# EAGLE design arduinoVisor3 (EAGLE 9.5.2)

## Sheet 1 of 2
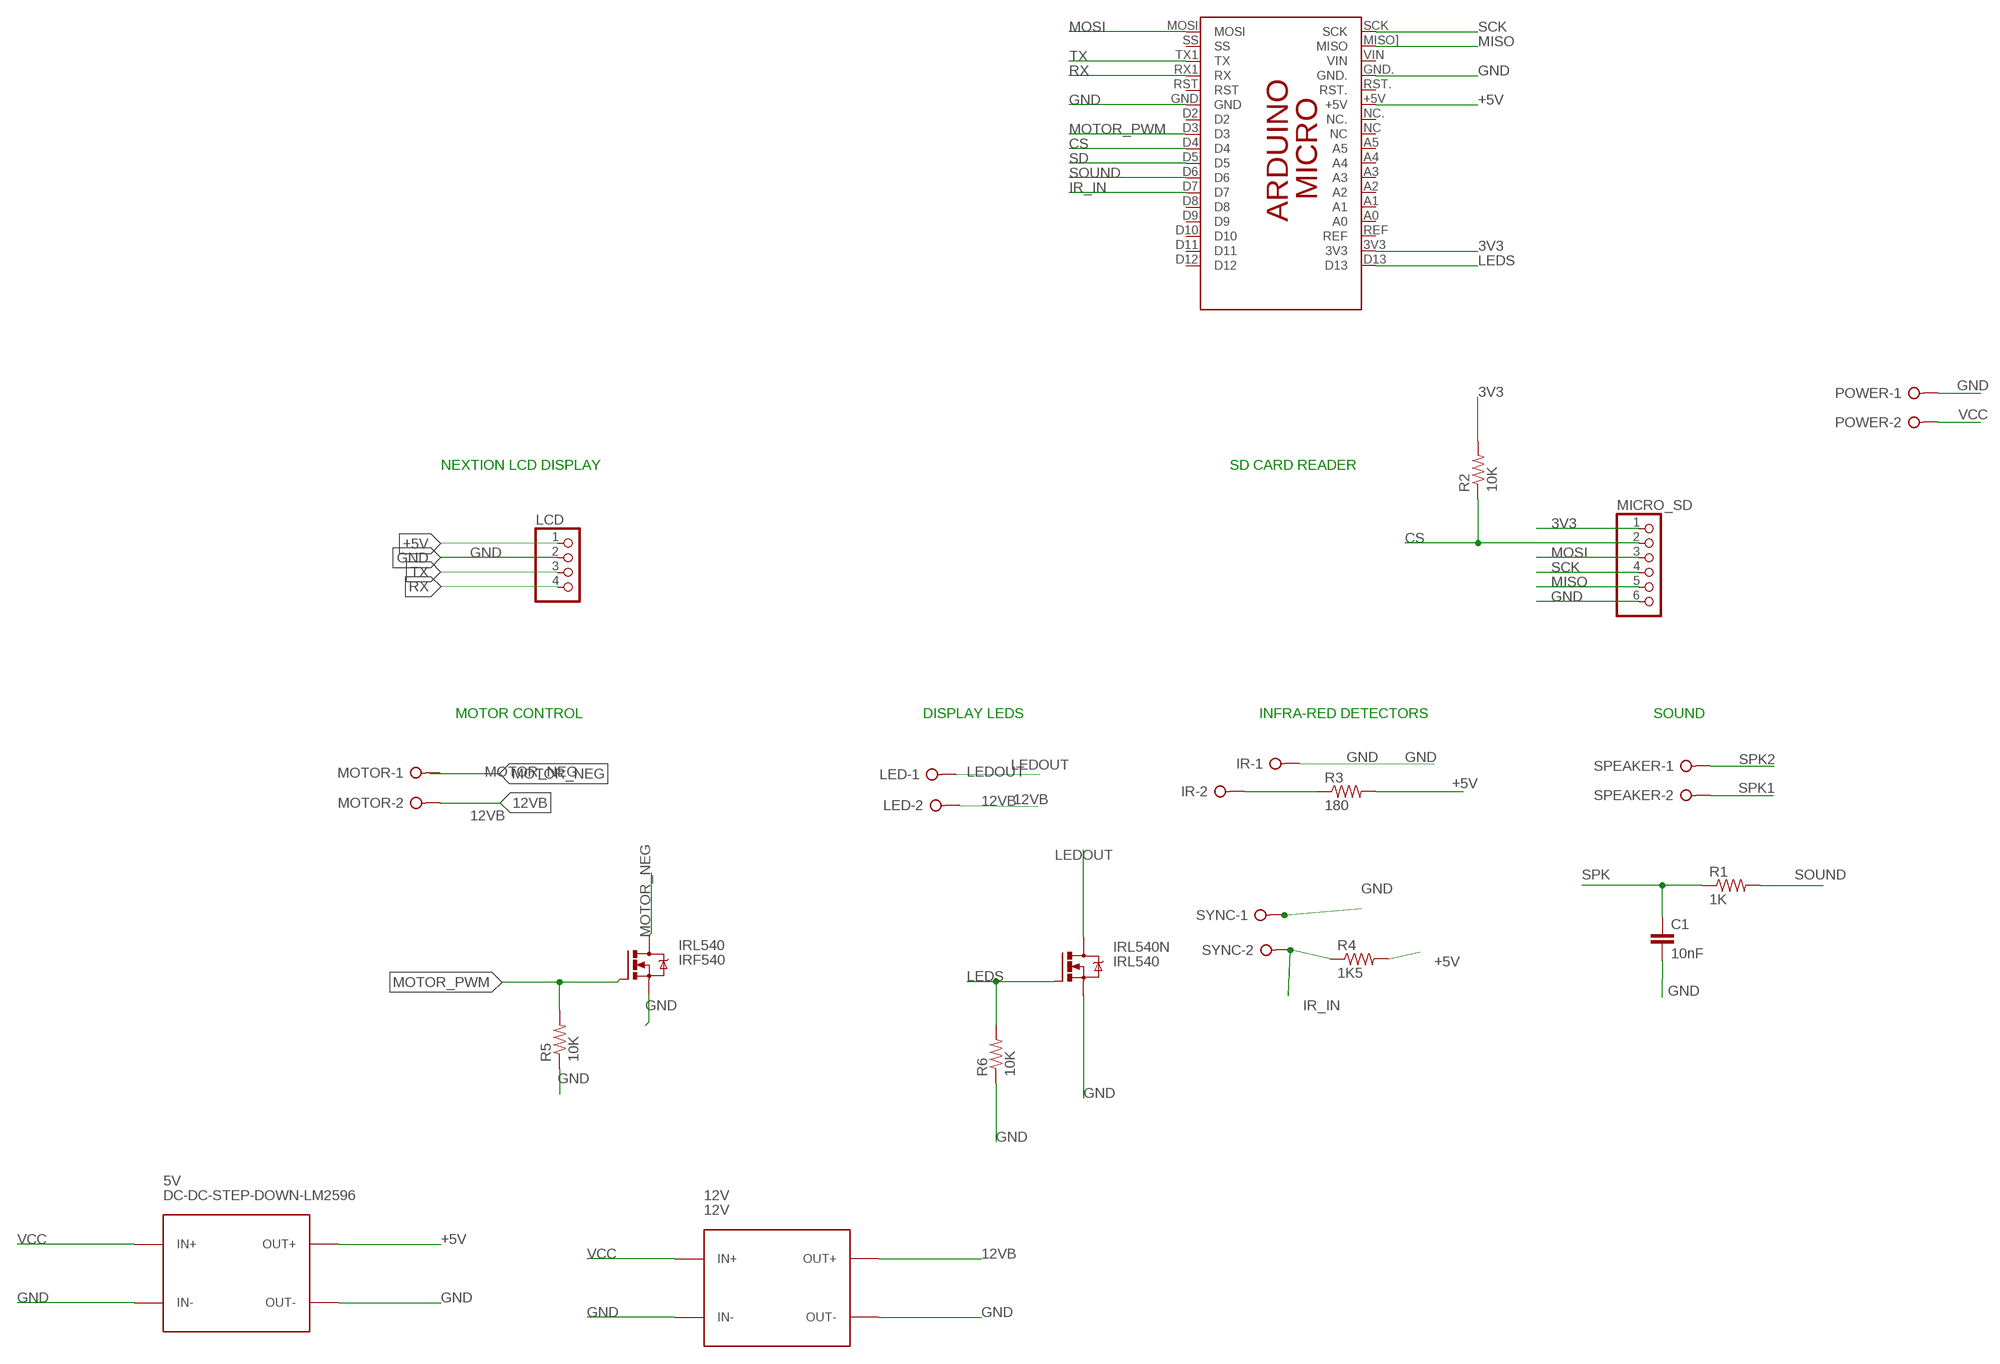
[diagram p0: schematic, sheet 1]

### Parts
5V  DC-DC-STEP-DOWN-LM2596  [DC-DC-STEP-DOWN-LM2596]
12V  12V  DC-DC-STEP-DOWN-LM2596  [DC-DC-STEP-DOWN-LM2596]
C1  10nF  C2.5/2  [C2.5-2]
IR  W237-02P  [W237-132]
IRL540  IRF540  [TO220BV]
IRL540N  IRL540  IRF540  [TO220BV]
LCD  PINHD-1X4  [1X04]
LED  W237-02P  [W237-132]
MICRO_SD  PINHD-1X6  [1X06]
MOTOR  W237-02P  [W237-132]
PCB2  ARDUINO_MICRO  [ARDUINO_MICRO]
POWER  W237-02P  [W237-132]
R1  1K  R-US_0207/10  [0207/10]
R2  10K  R-US_0207/10  [0207/10]
R3  180  R-US_0207/10  [0207/10]
R4  1K5  R-US_0207/10  [0207/10]
R5  10K  R-US_0207/10  [0207/10]
R6  10K  R-US_0207/10  [0207/10]
SPEAKER  W237-02P  [W237-132]
SYNC  W237-02P  [W237-132]

### Nets
3V3: MICRO_SD.1 PCB2.3V3 R2.2
12VB: 12V.OUT+ LED.2 MOTOR.2
+5V: 5V.OUT+ LCD.1 PCB2.+5V R3.2 R4.2 ; also sheet 2
CS: MICRO_SD.2 PCB2.D4 R2.1
GND: 5V.IN- 5V.OUT- 12V.IN- 12V.OUT- C1.2 IR.1 IRL540.S IRL540N.S LCD.2 MICRO_SD.6 PCB2.GND PCB2.GND. POWER.1 R5.1 R6.1 SYNC.1 ; also sheet 2
IR_IN: PCB2.D7 R4.1 SYNC.2
IR_OUT: IR.2 R3.1
LEDOUT: IRL540N.D LED.1
LEDS: IRL540N.G PCB2.D13 R6.2
MISO: MICRO_SD.5 PCB2.MISO](MISO)
MOSI: MICRO_SD.3 PCB2.MOSI
MOTOR_NEG: IRL540.D MOTOR.1
MOTOR_PWM: IRL540.G PCB2.D3 R5.2
RX: LCD.4 PCB2.RX1(RX)
SCK: MICRO_SD.4 PCB2.SCK
SD: PCB2.D5 ; also sheet 2
SOUND: PCB2.D6 R1.2
SPK: C1.1 R1.1 ; also sheet 2
SPK1: SPEAKER.2 ; also sheet 2
SPK2: SPEAKER.1 ; also sheet 2
TX: LCD.3 PCB2.TX1(TX)
VCC: 5V.IN+ 12V.IN+ POWER.2
Unconnected: PCB2.A0 PCB2.A1 PCB2.A2 PCB2.A3 PCB2.A4 PCB2.A5 PCB2.D2 PCB2.D8 PCB2.D9 PCB2.D10 PCB2.D11 PCB2.D12 PCB2.NC PCB2.NC. PCB2.REF PCB2.RST PCB2.RST. PCB2.SS PCB2.VIN

### Notes on the sheet
- NEXTION LCD DISPLAY | SD CARD READER
- MOTOR CONTROL | DISPLAY LEDS | INFRA-RED DETECTORS | SOUND

## Sheet 2 of 2
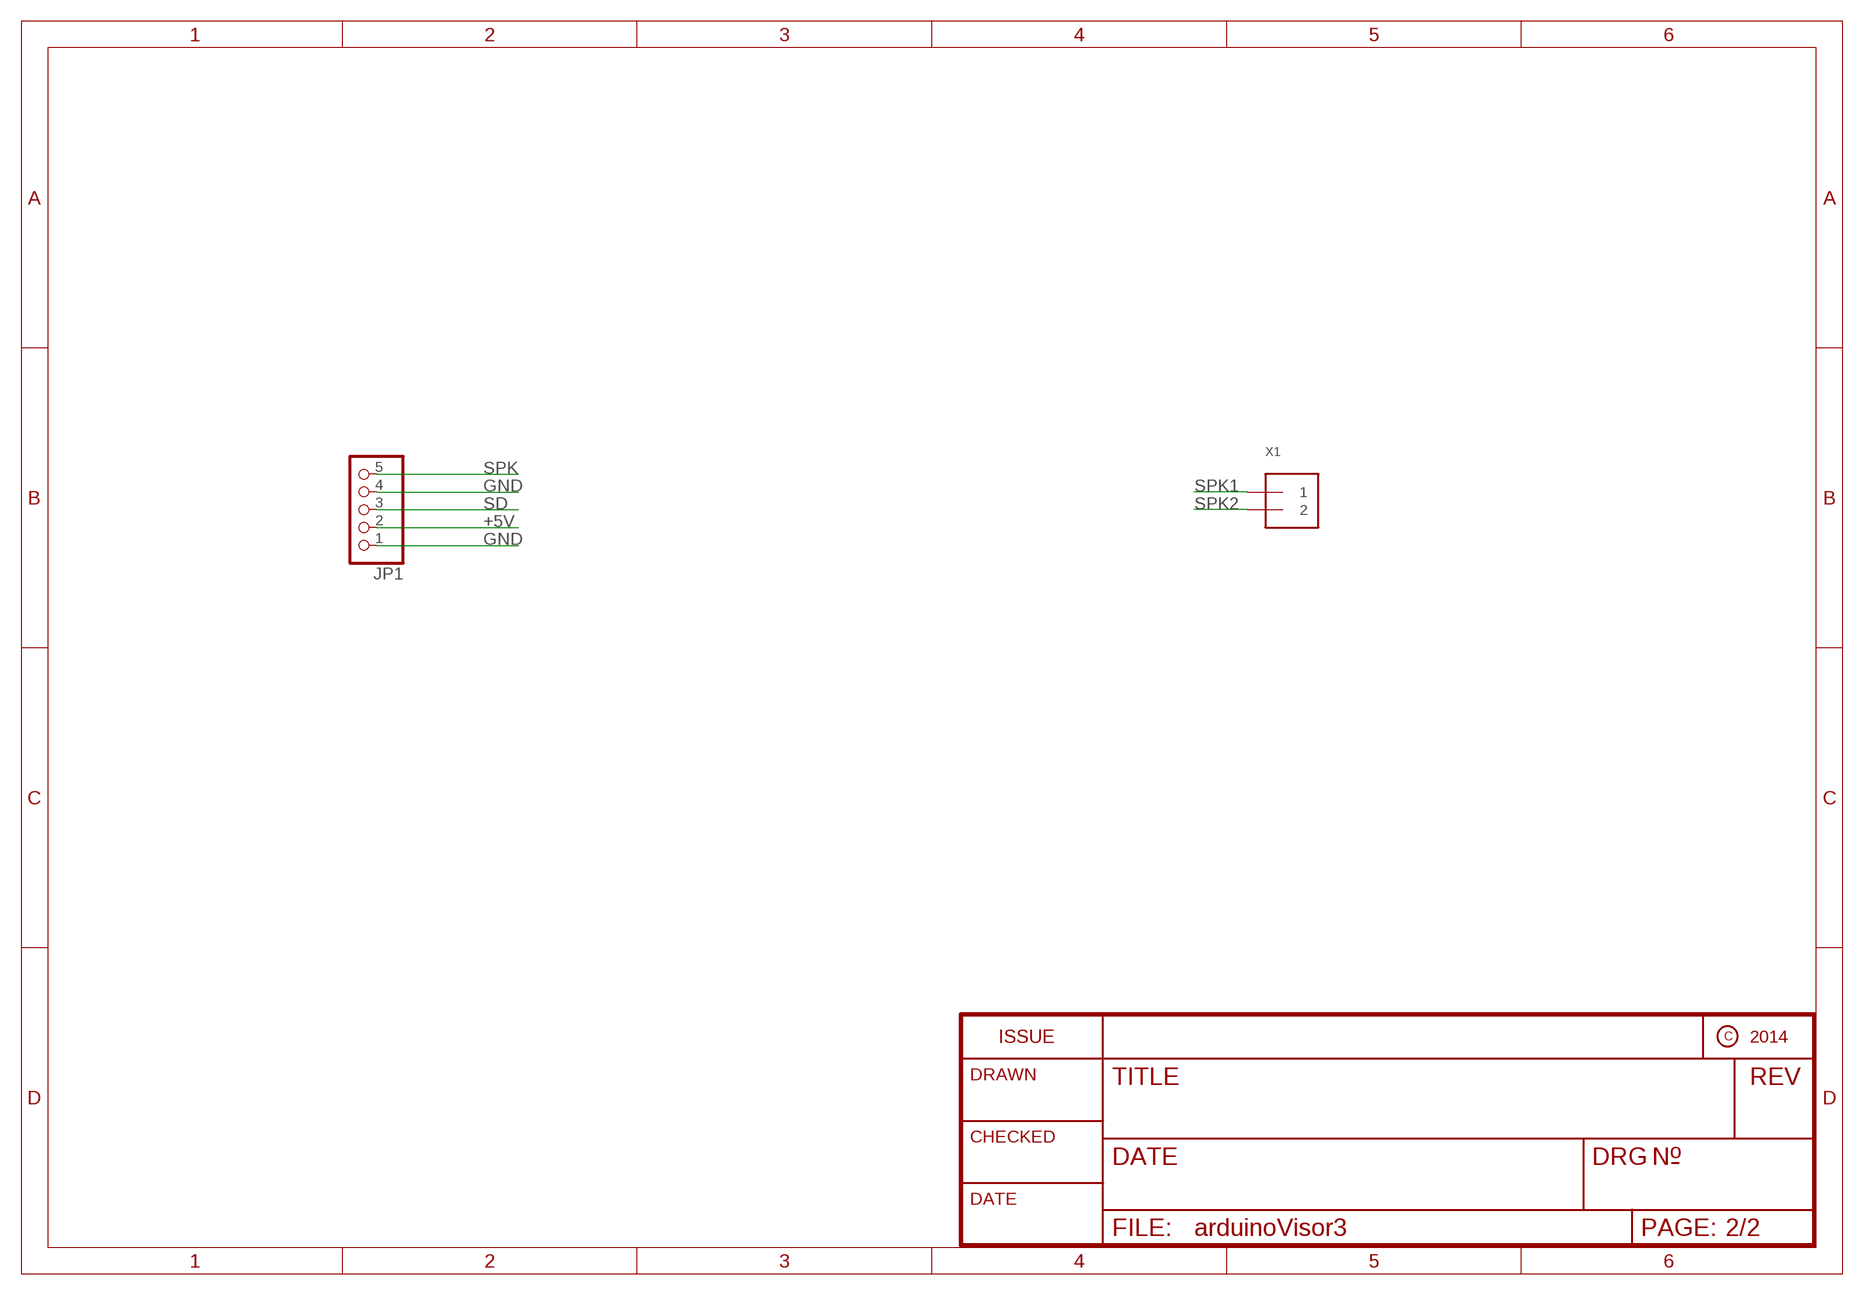
[diagram p1: schematic, sheet 2]

### Parts
JP1  HEADER-1X570MIL  [1X05_ROUND_70]
X1  TERMBLOCK_1X2  [TERMBLOCK_1X2-3.5MM]

### Nets
+5V: JP1.2 ; also sheet 1
GND: JP1.1 JP1.4 ; also sheet 1
SD: JP1.3 ; also sheet 1
SPK: JP1.5 ; also sheet 1
SPK1: X1.1 ; also sheet 1
SPK2: X1.2 ; also sheet 1

## Library data of the parts
5V 12V = diy-modules boo:DC-DC-STEP-DOWN-LM2596: DC/DC Step-Down Regulator based on LM2596-ADJ chip LM2596 datasheet available here: http://www.ti.com/lit/ds/symlink/lm2596.pdf Click here to find device on ebay.com <http://www.ebay.com/sch/lm2596+power+regulator>
C1 = capacitor-wima:C: CAPACITOR naming: grid - package width
IR LED MOTOR POWER SPEAKER SYNC = con-wago-508:W237-02P: WAGO SREW CLAMP; OC_FARNELL: unknown; OC_NEWARK: unknown
IRL540 IRL540N = transistor-power:IRF540: HEXFET Power MOSFET
JP1 = microbuilder:HEADER-1X5: PIN HEADER
LCD = pinhead:PINHD-1X4: PIN HEADER
MICRO_SD = pinhead:PINHD-1X6: PIN HEADER
PCB2 = E14_Arduino_revC 2 boo:ARDUINO_MICRO: Device for representing an Arduino Micro board with a footprint in an EAGLE design. Created by Dave Young for Element14. More EAGLE documentation at: http://www.element14.com/community/community/knode/cadsoft_eagle
R1-R6 = rcl:R-US_: RESISTOR, American symbol
X1 = microbuilder:TERMBLOCK_1X2: 3.5mm Terminal block http://www.ladyada.net/library/pcb/eaglelibrary.html

## Board
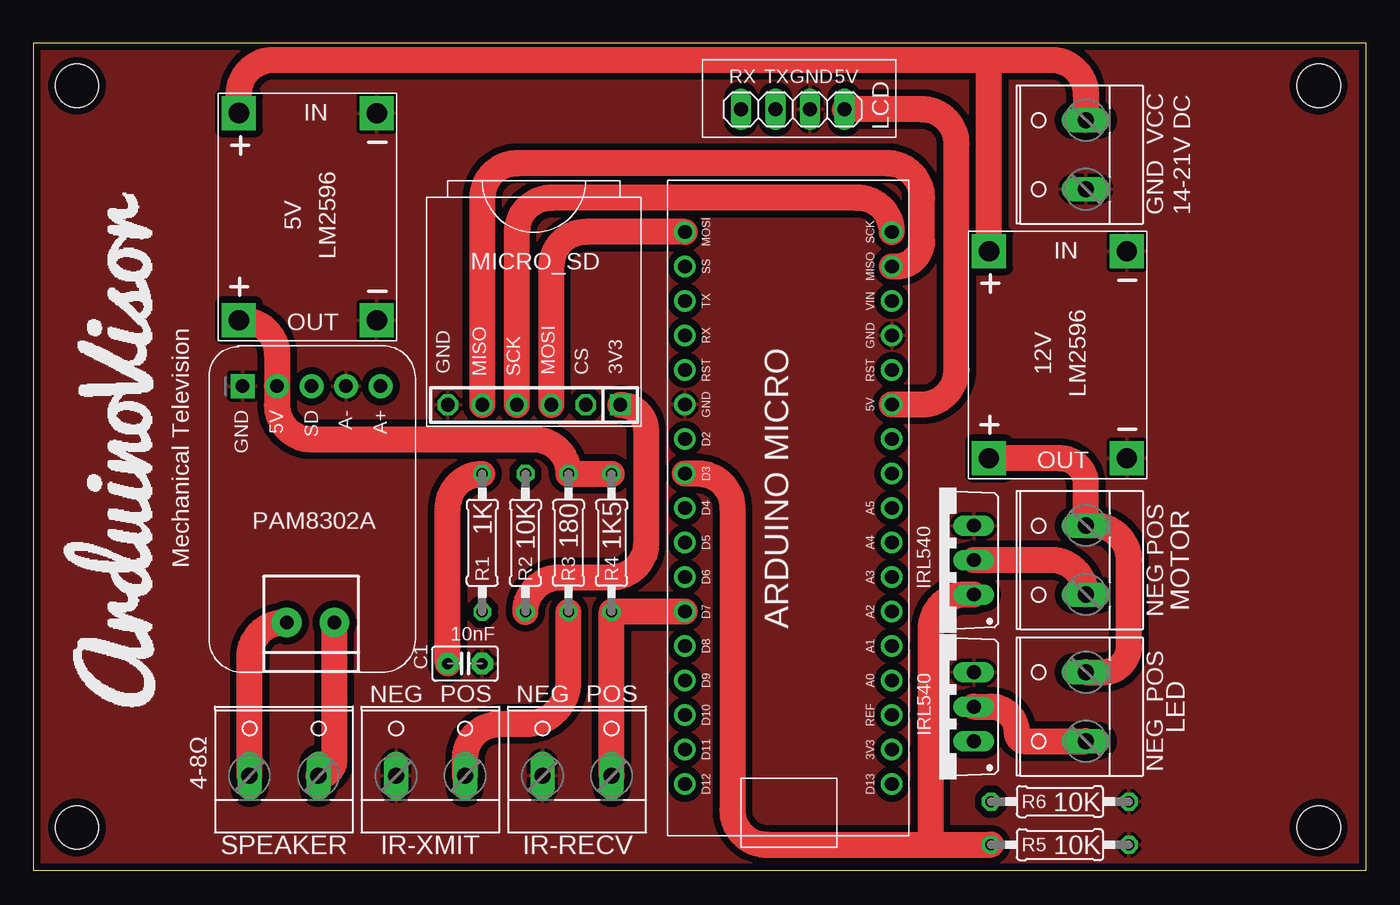
[diagram p2: board, top side]
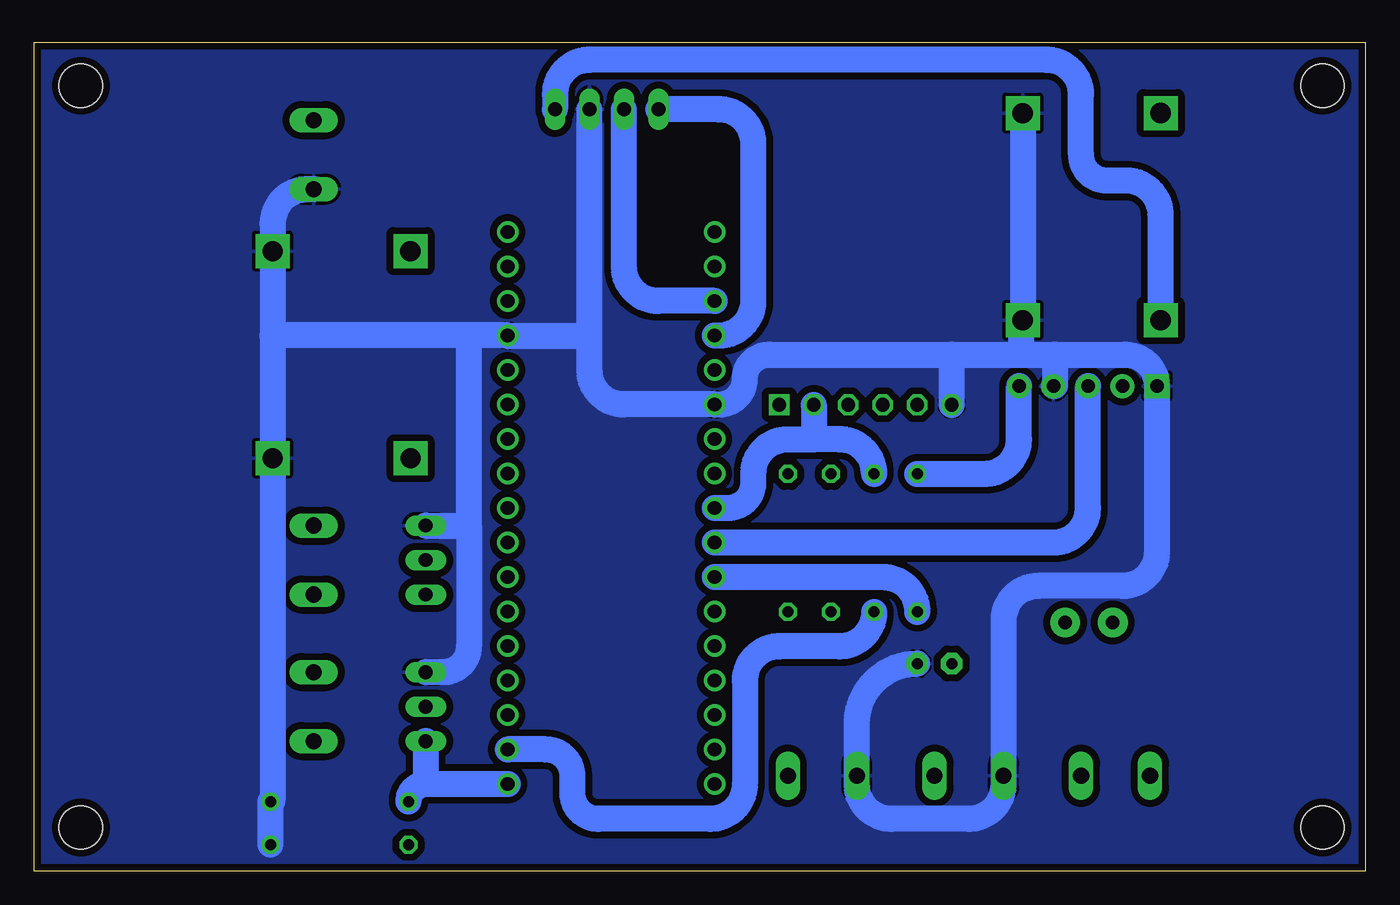
[diagram p3: board, bottom side, seen from below]

Size 98.07 x 60.96 mm. Coordinates in mm from the lower left corner, seen from the top.
Outline: 0,60.96 98.07,60.96 98.07,0 0,0 0,60.96
Copper layers (1*16): Top 0.035mm / dielectric 1.5mm / Bottom 0.035mm
Design rules "SeeedStudio_2layer_DRU_no_angle_20140221": minimum track width 6mil, minimum drill 12mil, track to track 6mil, track to pad 6mil, pad to pad 6mil, via to via 6mil, smd to smd 0mil, copper to edge 10mil, drill to drill 10mil, minimum pad ring 10mil, minimum via ring 6mil, stop-mask expansion 2mil, vias tented up to drill 100mil, thermal gap 10mil
Holes 3.2 mm at 3.17,57.78 94.61,57.78 3.17,3.17 94.61,3.17

### Footprints (pad centres in the part's own frame; a part is rotated, then mirrored left to right if it is on the bottom)
DC-DC-STEP-DOWN-LM2596 = drill 1.5 pad 2.5 square: IN+ 1.388,0.485; IN- 1.388,10.641; OUT+ 16.632,0.48; OUT- 16.631,10.641
C2.5-2 = drill 0.813 pad 1.6 octagon: 1 -1.27,0; 2 1.27,0
W237-132 = drill 1.194 long: 1 -2.54,-0.635; 2 2.54,-0.635
TO220BV = drill 1.016 long: D 0,-2.54; G -2.54,-2.54; S 2.54,-2.54
1X05_ROUND_70 = drill 1 pad 1.778 square: 1 -5.08,0 | drill 1 pad 1.778: 2 -2.54,0; 3 0,0; 4 2.54,0; 5 5.08,0
1X04 = drill 1.016 long: 1 -3.81,0; 2 -1.27,0; 3 1.27,0; 4 3.81,0
1X06 = drill 1.016 square: 1 -6.35,0 | drill 1.016 octagon: 2 -3.81,0; 3 -1.27,0; 4 1.27,0; 5 3.81,0; 6 6.35,0
ARDUINO_MICRO = drill 1.016 pad 1.575: 3V3 6.35,1.27; +5V 31.75,1.27; A0 11.43,1.27; A1 13.97,1.27; A2 16.51,1.27; A3 19.05,1.27; A4 21.59,1.27; A5 24.13,1.27; D2 29.21,16.51; D3 26.67,16.51; D4 24.13,16.51; D5 21.59,16.51; D6 19.05,16.51; D7 16.51,16.51; D8 13.97,16.51; D9 11.43,16.51; D10 8.89,16.51; D11 6.35,16.51; D12 3.81,16.51; D13 3.81,1.27; GND 31.75,16.51; GND. 36.83,1.27; MISO] 41.91,1.27; MOSI 44.45,16.51; NC 26.67,1.27; NC. 29.21,1.27; REF 8.89,1.27; RST 34.29,16.51; RST. 34.29,1.27; RX1 36.83,16.51; SCK 44.45,1.27; SS 41.91,16.51; TX1 39.37,16.51; VIN 39.37,1.27
0207/10 = drill 0.813 octagon: 1 -5.08,0; 2 5.08,0
TERMBLOCK_1X2-3.5MM = drill 1 pad 2.184: 1 1.8,0; 2 -1.7,0

### Placement (x,y rotation side)
5V  14.61,57.15 270 top
12V  69.85,46.99 270 top
C1  31.75,15.24 0 top
IR  29.21,7.62 0 top
IRL540  66.67,22.86 90 top
IRL540N  66.67,12.06 90 top
JP1  20.44,35.67 0 top
LCD  55.89,56.05 180 top
LED  76.83,12.06 90 top
MICRO_SD  36.83,34.29 180 top
MOTOR  76.83,22.86 90 top
PCB2  64.45,2.57 90 top
POWER  76.83,52.7 90 top
R1  33.02,24.13 270 top
R2  36.2,24.13 270 top
R3  39.37,24.13 90 top
R4  42.55,24.13 90 top
R5  75.56,1.91 180 top
R6  75.56,5.08 180 top
SPEAKER  18.41,7.62 0 top
SYNC  40.01,7.62 0 top
X1  20.32,18.27 0 top

### Tracks (layer width: path | path; a pad name or v marks a point on that pad's centre or on a via)
3V3
  Top 1.905: R2.2 arc-90 38.73,21.59 42.55,21.59 arc90 45.09,24.13 45.09,32.38 arc90 MICRO_SD.1
  Bottom 1.905: R2.2 arc90 38.73,16.51 43.18,16.51 arc-90 45.72,13.97 45.72,6.35 arc90 48.26,3.81 56.52,3.81 arc90 58.42,5.71 58.42,6.99 arc-90 60.35,8.92 PCB2.3V3
12VB
  Top 1.905: 12V.OUT+ 75.56,30.36 arc-90 77.47,28.45 MOTOR.2 78.11,25.4 arc-90 80.64,22.86 80.64,16.51 arc-90 78.74,14.61 LED.2
+5V
  Top 1.905: PCB2.+5V 65.41,34.32 arc90 67.94,36.86 67.94,53.51 arc90 65.41,56.05 LCD.1 | 5V.OUT+ 15.36,40.52 arc-90 17.9,37.98 JP1.2 17.9,34.29 arc90 20.44,31.75 36.83,31.75 arc-90 R3.2 R4.2
  Bottom 1.905: 5V.OUT+ 15.09,48.26 arc-90 17.62,50.8 19.05,50.8 arc90 20.95,52.7 20.95,57.15 arc-90 23.5,59.69 57.16,59.69 arc-90 59.7,57.15 LCD.1
CS
  Bottom 1.905: R2.1 arc-90 38.73,31.75 40.64,31.75 | MICRO_SD.2 40.64,31.75 | 40.64,31.75 42.58,31.75 arc-90 45.09,29.24 45.09,28.57 arc90 46.96,26.7 PCB2.D4
GND
  Bottom 1.905: 5V.IN- 5V.OUT- | 5V.OUT- arc-90 5V.OUT- | C1.2 arc-90 37.47,10.79 SYNC.1 37.47,6.35 arc-90 34.92,3.81 29.21,3.81 arc-90 26.67,6.35 IR.1 26.67,18.41 arc90 24.13,20.95 17.9,20.95 arc-90 15.36,23.5 JP1.1 arc-90 17.68,37.98 22.86,37.98 | 80.49,39.37 12V.IN- 80.49,47.62 arc90 77.95,50.16 POWER.1 | 80.49,39.37 12V.OUT- | 12V.OUT- arc-90 12V.OUT- | 57.16,39.37 57.16,36.86 arc-90 54.62,34.32 PCB2.GND 47.59,34.32 arc-90 45.72,36.2 arc90 43.94,37.98 30.48,37.98 | 57.16,39.37 LCD.2 | 57.16,39.37 63.15,39.37 arc90 PCB2.GND. 66.04,39.4 | IRL540N.S 67.94,14.61 arc-90 66.04,16.51 66.04,25.4 | IRL540.S 66.04,25.4 | 80.46,39.4 arc-90 80.49,39.37 | 66.04,39.4 80.46,39.4 | 80.46,39.4 arc-90 80.49,39.37 | 66.04,25.4 66.04,39.4 | 30.48,37.98 25.4,37.98 | 25.4,37.98 22.86,37.98 | 5V.OUT- arc-90 25.4,40.37 25.4,37.98 | JP1.4 arc-90 22.86,35.79 22.86,37.98 | MICRO_SD.6 30.48,37.98 | 12V.OUT- 80.49,5.23 arc90 R6.1 R5.1
  pour Bottom (isolate 0.508): 0,60.96 0,0 98.42,0 98.42,60.96
  pour Top (isolate 0.508): 0,60.96 0,0 97.79,0 97.79,60.96
IR_IN
  Top 1.905: R4.1 arc-90 42.58,19.08 | 42.58,19.08 42.55,19.08 SYNC.2 | 42.58,19.08 PCB2.D7
IR_OUT
  Top 1.905: IR.2 31.75,8.26 arc-90 34.29,10.79 36.2,10.79 arc90 39.37,13.97 R3.1
LEDOUT
  Top 1.905: IRL540N.D 70.48,12.06 arc-90 72.39,10.16 arc90 73.03,9.53 LED.1
LEDS
  Bottom 1.905: R6.2 arc90 69.19,6.38 | 69.19,6.38 PCB2.D13 | IRL540N.G 69.22,6.41 arc-90 69.19,6.38
MISO
  Top 1.905: PCB2.MISO] 63.53,44.48 arc90 65.41,46.35 65.41,49.53 arc90 62.87,52.07 35.56,52.07 arc90 33.02,49.53 MICRO_SD.5
MOSI
  Top 1.905: PCB2.MOSI 40.64,47.02 arc90 38.1,44.48 MICRO_SD.3
MOTOR_NEG
  Top 1.905: MOTOR.1 arc90 74.93,22.86 IRL540.D
MOTOR_PWM
  Top 1.905: PCB2.D3 48.9,29.24 arc-90 51.44,26.7 51.44,4.45 arc90 53.98,1.91 66.04,1.91 | 66.04,1.91 R5.2 | IRL540.G 68.58,20.32 arc90 66.04,17.78 66.04,1.91
RX
  Bottom 1.905: PCB2.RX1 47.62,39.4 arc-90 45.09,41.94 45.09,53.51 arc-90 47.62,56.05 LCD.4
SCK
  Top 1.905: PCB2.SCK arc90 60.67,49.53 38.1,49.53 arc90 35.56,46.99 MICRO_SD.4
SD
  Bottom 1.905: PCB2.D5 22.98,24.16 arc-90 20.44,26.7 JP1.3
SOUND
  Bottom 1.905: PCB2.D6 35.56,21.62 arc90 33.02,19.08 R1.2
SPK
  Top 1.905: C1.1 30.48,26.67 arc-90 R1.1
  Bottom 1.905: R1.1 28.06,29.21 arc-90 25.52,31.75 JP1.5
SPK1
  Top 1.905: X1.1 22.12,8.15 arc-90 SPEAKER.2
SPK2
  Top 1.905: SPEAKER.1 15.88,15.73 arc-90 18.41,18.27 X1.2
TX
  Bottom 1.905: PCB2.TX1 52.08,41.94 arc90 54.62,44.48 LCD.3
VCC
  Top 1.905: 5V.IN+ 15.09,57.15 arc-90 17.63,59.69 70.48,59.69 | POWER.2 77.47,57.15 arc90 74.93,59.69 70.48,59.69 | 12V.IN+ 70.33,59.54 arc-90 70.48,59.69

### Text on the board
tPlace: RX | TX | GND | 5V | VCC | 14-21V DC | GND | GND | MOSI | CS | 3V3 | MISO | SCK | GND | 5V | SD | A- | A+ | Mechanical Television | PAM8302A | POS | MOTOR | NEG | POS | NEG | POS | NEG | POS | LED | NEG | 4-8Ω | SPEAKER | IR-XMIT | IR-RECV
tNames: IRL540 | IRL540